# Altium schematic sheet Sheet1.SchDoc
size A; SheetNumber: 1; SheetTotal: 1
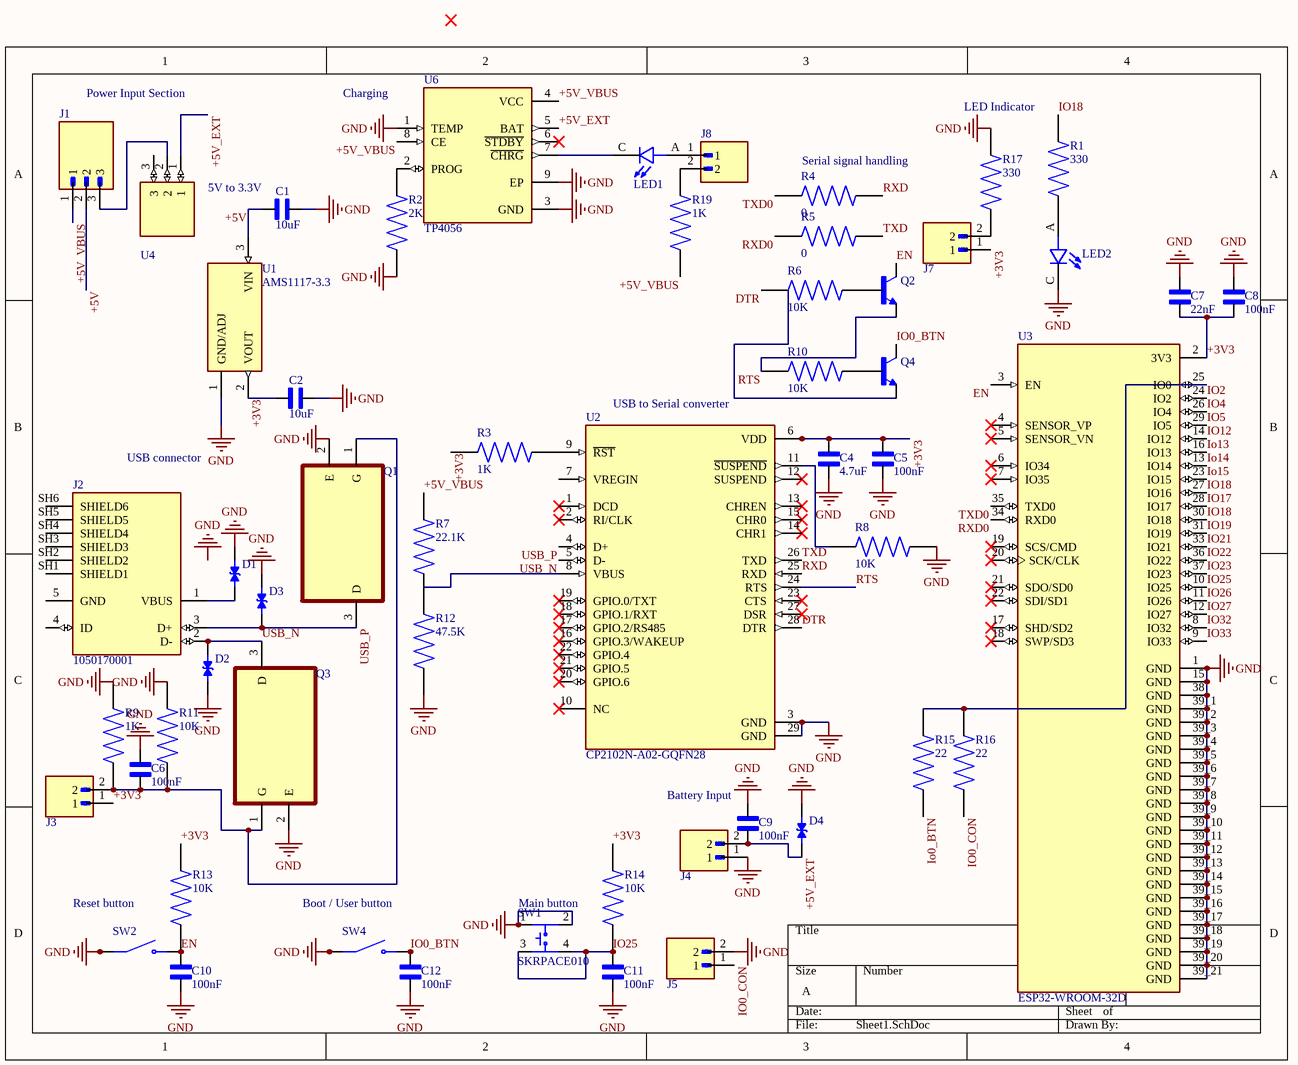
[diagram p0: Sheet1.SchDoc]

## Parts
C1  10uF  [CAPC1005X70N]
C2  10uF  [CAPC1005X70N]
C4  4.7uF  [CAPC1005X70N]
C5  100nF  [CAPC1005X70N]
C6  100nF  [CAPC1005X70N]
C7  22nF  [CAPC1005X70N]
C8  100nF  [CAPC1005X70N]
C9  100nF  [CAPC1005X70N]
C10  100nF  [CAPC1005X70N]
C11  100nF  [CAPC1005X70N]
C12  100nF  [CAPC1005X70N]
D1  LESD5D5.0CT1G  [TVS_LESD5D5.0CT1G]  (value not drawn)
D2  LESD5D5.0CT1G  [TVS_LESD5D5.0CT1G]  (value not drawn)
D3  LESD5D5.0CT1G  [TVS_LESD5D5.0CT1G]  (value not drawn)
D4  LESD5D5.0CT1G  [TVS_LESD5D5.0CT1G]  (value not drawn)
J1  M20-9990345  [HARWIN_M20-9990345]  (value not drawn)
J2  1050170001  [MOLEX_1050170001]
J3  M20-9990245  [HARWIN_M20-9990245]  (value not drawn)
J4  M20-9990245  [HARWIN_M20-9990245]  (value not drawn)
J5  M20-9990245  [HARWIN_M20-9990245]  (value not drawn)
J7  M20-9990245  [HARWIN_M20-9990245]  (value not drawn)
J8  M20-9990245  [HARWIN_M20-9990245]  (value not drawn)
LED1  SM0805UGC  [LEDC2012X135N]  (value not drawn)
LED2  SM0805UGC  [LEDC2012X135N]  (value not drawn)
Q1  2N7002T-7-F  [SOT50P160X90-3N]  (value not drawn)
Q2  SS8050-G  [TRANS_SS8050-G]  (value not drawn)
Q3  2N7002T-7-F  [SOT50P160X90-3N]  (value not drawn)
Q4  SS8050-G  [TRANS_SS8050-G]  (value not drawn)
R1  330  [RESC1005X40N]
R2  2K  [RESC1005X40N]
R3  1K  [RESC1005X40N]
R4  0  [RESC1005X40N]
R5  0  [RESC1005X40N]
R6  10K  [RESC1005X40N]
R7  22.1K  [RESC1005X40N]
R8  10K  [RESC1005X40N]
R9  1K  [RESC1005X40N]
R10  10K  [RESC1005X40N]
R11  10K  [RESC1005X40N]
R12  47.5K  [RESC1005X40N]
R13  10K  [RESC1005X40N]
R14  10K  [RESC1005X40N]
R15  22  [RESC1005X40N]
R16  22  [RESC1005X40N]
R17  330  [RESC1005X40N]
R19  1K  [RESC1005X40N]
SW1  SKRPACE010  [SW_SKRPACE010]
SW2  EVQ-P7A01P  [SW_EVQ-P7A01P]  (value not drawn)
SW4  EVQ-P7A01P  [SW_EVQ-P7A01P]  (value not drawn)
U1  AMS1117-3.3  [SOT229P700X180-4N]
U2  CP2102N-A02-GQFN28  [QFN50P500X500X80-29N]
U3  ESP32-WROOM-32D  [MODULE_ESP32-WROOM-32D]
U4  OS102011MA1QN1  [OS102011MA1QN1]  (value not drawn)
U6  TP4056  [SOP127P600X175-9N]

## Nets
GND: C1.1 C2.1 C4.1 C5.1 C6.2 C7.2 C8.2 C9.2 C10.1 C11.1 C12.1 D1.2 D2.1 D3.2 D4.2 J4.1 J5.2 LED2.C Q1.2(E) Q3.2(E) R2.1 R8.2 R9.2 R11.2 R12.1 R17.2 SW1.1 SW1.2 SW2.1_1 SW2.1_2 SW4.1_1 SW4.1_2 U1.1(GND/ADJ) U2.3(GND) U2.29(GND) U3.1(GND) U3.15(GND) U3.38(GND) U3.39_1(GND) U3.39_2(GND) U3.39_3(GND) U3.39_4(GND) U3.39_5(GND) U3.39_6(GND) U3.39_7(GND) U3.39_8(GND) U3.39_9(GND) U3.39_10(GND) U3.39_11(GND) U3.39_12(GND) U3.39_13(GND) U3.39_14(GND) U3.39_15(GND) U3.39_16(GND) U3.39_17(GND) U3.39_18(GND) U3.39_19(GND) U3.39_20(GND) U3.39_21(GND) U6.1(TEMP) U6.3(GND) U6.9(EP)
+3V3: C2.2 C4.2 C5.2 C7.1 C8.1 J3.1 J7.1 R3.2 R13.2 R14.2 U1.2(VOUT) U2.6(VDD) U2.7(VREGIN) U3.2(3V3)
+5V: C1.2 J1.2 U1.3(VIN)
+5V_EXT: C9.1 D4.1 J4.2 U4.1 U6.5(BAT)
+5V_VBUS: J1.1 R7.2 R19.1 U6.4(VCC) U6.8(CE)
DTR: R6.1 U2.28(DTR)
EN: C10.2 Q2.3(C) R13.1 SW2.2_1 SW2.2_2 U3.3(EN)
IO0_BTN: C12.2 Q4.3(C) R15.1 SW4.2_1 SW4.2_2
IO0_CON: J5.1 R16.1
IO2: U3.24(IO2)
IO4: U3.26(IO4)
IO5: U3.29(IO5)
IO12: U3.14(IO12)
Io13: U3.16(IO13)
Io14: U3.13(IO14)
Io15: U3.23(IO15)
IO17: U3.28(IO17)
IO18: R1.2 U3.27(IO16) U3.30(IO18)
IO19: U3.31(IO19)
IO21: U3.33(IO21)
IO22: U3.36(IO22)
IO23: U3.37(IO23)
IO25: C11.2 R14.1 SW1.3 SW1.4 U3.10(IO25)
IO26: U3.11(IO26)
IO27: U3.12(IO27)
IO32: U3.8(IO32)
IO33: U3.9(IO33)
RTS: Q2.2(E) R10.1 U2.24(RTS)
RXD: R4.2 U2.25(RXD)
RXD0: R5.1 U3.34(RXD0)
TXD: R5.2 U2.26(TXD)
TXD0: R4.1 U3.35(TXD0)
USB_N: D2.2 J2.2(D-) Q3.3(D) U2.5(D-)
USB_P: D3.1 J2.3(D+) Q1.3(D) U2.4(D+)
NetC6_1: C6.1 J3.2 Q1.1(G) Q3.1(G) R9.1 R11.1
NetD1_1: D1.1 J2.1(VBUS)
NetJ1_3: J1.3 U4.2
NetJ7_2: J7.2 R17.1
NetJ8_1: J8.1 LED1.A
NetJ8_2: J8.2 R19.2
NetLED1_C: LED1.C U6.7(~{CHRG})
NetLED2_A: LED2.A R1.1
NetQ2_1: Q2.1(B) R6.2
NetQ4_1: Q4.1(B) R10.2
NetR2_2: R2.2 U6.2(PROG)
NetR3_1: R3.1 U2.9(~{RST})
NetR8_1: R8.1 U2.11(~{SUSPEND})
NetR12_2: R12.2 U2.8(VBUS)
NetR15_2: R15.2 R16.2 U3.25(IO0)

Not connected (* = marked no-connect by the designer): J2 4(ID) 5(GND) SH1(SHIELD1) SH2(SHIELD2) SH3(SHIELD3) SH4(SHIELD4) SH5(SHIELD5) SH6(SHIELD6); Q4 2(E); R7 1; U2 1(DCD)* 2(RI/CLK)* 10(NC)* 12(SUSPEND)* 13(CHREN)* 14(CHR1)* 15(CHR0)* 16(GPIO.3/WAKEUP)* 17(GPIO.2/RS485)* 18(GPIO.1/RXT)* 19(GPIO.0/TXT)* 20(GPIO.6)* 21(GPIO.5)* 22(GPIO.4)* 23(CTS)* 27(DSR)*; U3 4(SENSOR_VP)* 5(SENSOR_VN)* 6(IO34)* 7(IO35)* 17(SHD/SD2)* 18(SWP/SD3)* 19(SCS/CMD)* 20(SCK/CLK)* 21(SDO/SD0)* 22(SDI/SD1)*; U4 3; U6 6(~{STDBY})*

## Notes on the sheet
- Power Input Section
- (near U6) Charging
- LED Indicator
- (near C1) 5V to 3.3V
- (near R4) Serial signal handling
- (near U2) USB to Serial converter
- (near J2) USB connector
- (near C9) Battery Input
- Reset button
- Boot / User button
- (near SW1) Main button
- Labels drawn without touching a wire or pin: GND

## Library data of the parts
C1 C2 C4 C6-C12 = CL05A475KP5NRNC: 4.7 ÂµF Â±10% 10V Ceramic Capacitor X5R 0402 (1005 Metric); MF: Samsung Electro-Mechanics; SnapEDA_Link: https://www.snapeda.com/parts/CL05A475KP5NRNC/Samsung/view-part/?ref=snap; Package: SMD-2-2 Samsung; Value: *; MP: CL05A475KP5NRNC; Check_prices: https://www.snapeda.com/parts/CL05A475KP5NRNC/Samsung/view-part/?ref=eda
C5 = CL05B104KO5NNNC: 0.1 ÂµF Â±10% 16V Ceramic Capacitor X7R 0402 (1005 Metric); MF: Samsung; SnapEDA_Link: https://www.snapeda.com/parts/CL05B104KO5NNNC/Samsung/view-part/?ref=snap; Package: SMD-2-2 Samsung; Value: *; MP: CL05B104KO5NNNC; Check_prices: https://www.snapeda.com/parts/CL05B104KO5NNNC/Samsung/view-part/?ref=eda
D1-D4 = LESD5D5.0CT1G: Transient Voltage Suppressors for ESD Protection; MF: Leshan Radio Co.; Check_prices: https://www.snapeda.com/parts/LESD5D5.0CT1G/Leshan+Radio+Co./view-part/?ref=eda; Value: *; Availability: Not in stock; Package: None; SnapEDA_Link: https://www.snapeda.com/parts/LESD5D5.0CT1G/Leshan+Radio+Co./view-part/?ref=snap; MP: LESD5D5.0CT1G; Price: None
J1 = M20-9990345: 2.54mm (0.1) Pitch SIL Vertical Throughboard Pin Header, 6.1mm mating pin height, gold (hi-temp mould), 3 contacts; MF: Harwin; SnapEDA_Link: https://www.snapeda.com/parts/M20-9990345/Harwin+Inc./view-part/?ref=snap; Package: None; Value: *; MP: M20-9990345; Check_prices: https://www.snapeda.com/parts/M20-9990345/Harwin+Inc./view-part/?ref=eda
J2 = 1050170001: USB - micro B USB 2.0 Receptacle Connector 5 Position Surface Mount, Right Angle; Through Hole; MF: Molex; SnapEDA_Link: https://www.snapeda.com/parts/1050170001/Molex/view-part/?ref=snap; Package: None; Value: *; MP: 1050170001; Check_prices: https://www.snapeda.com/parts/1050170001/Molex/view-part/?ref=eda
J3-J5 J7 J8 = M20-9990245: MF: Harwin; Package: None; Price: None; Value: *; MP: M20-9990245; Availability: Unavailable
LED1 LED2 = SM0805UGC: Green 565nm LED Indication - Discrete 2V 0805 _2012 Metric_; MF: Bivar Inc.; Package: 0805 Bivar; Value: *; Availability: Unavailable; MP: SM0805UGC; SnapEDA_Link: https://www.snapeda.com/parts/SM0805UGC/Bivar%20Inc./view-part/841191/?ref=snap; Price: None
Q1 Q3 = 2N7002T-7-F: MOSFET N-Channel 60V 0.115A SOT523 | Diodes Inc 2N7002T-7-F; MF: Diodes Inc.; SnapEDA_Link: https://www.snapeda.com/parts/2N7002T-7-F/Diodes+Inc./view-part/?ref=snap; Package: SOT-523 Diodes Inc.; Value: *; MP: 2N7002T-7-F; Check_prices: https://www.snapeda.com/parts/2N7002T-7-F/Diodes+Inc./view-part/?ref=eda
Q2 Q4 = SS8050-G: Bipolar (BJT) Transistor NPN 25 V 1.5 A 100MHz 300 mW Surface Mount SOT-23-3; MP: SS8050G; MF: Comchip; Digi-Key_Part_Number: 641-1790-2-ND; Check_prices: https://www.snapeda.com/parts/SS8050G/Comchip/view-part/?ref=eda; Package: None; SnapEDA_Link: https://www.snapeda.com/parts/SS8050G/Comchip/view-part/?ref=snap; Value: *
R1 R17 = 0402WGF3300TCE: 330 Ohm 1/16W Thick Film Resistor 0402 Chip - Surface Mount; MF: Uni-Royal; SnapEDA_Link: https://www.snapeda.com/parts/0402WGF3300TCE/Uni-Royal/view-part/?ref=snap; Package: 0402-2 ROYAL; Value: *; MP: 0402WGF3300TCE; Check_prices: https://www.snapeda.com/parts/0402WGF3300TCE/Uni-Royal/view-part/?ref=eda
R2 R3 R9 R19 = 0402WGF2001TCE: 2K Ohm 1/16W Thick Film Resistor 0402 Chip - Surface Mount; MF: Uni-Royal; SnapEDA_Link: https://www.snapeda.com/parts/0402WGF2001TCE/Uni-Royal/view-part/?ref=snap; Package: 0402-2 ROYAL; Value: *; MP: 0402WGF2001TCE; Check_prices: https://www.snapeda.com/parts/0402WGF2001TCE/Uni-Royal/view-part/?ref=eda
R4 R5 = 0402WGF0000TCE: 0 Ohm 1/16W Thick Film Resistor 0402 Chip - Surface Mount; MF: Uni-Royal; SnapEDA_Link: https://www.snapeda.com/parts/0402WGF0000TCE/Uni-Royal/view-part/?ref=snap; Package: None; Value: *; MP: 0402WGF0000TCE; Check_prices: https://www.snapeda.com/parts/0402WGF0000TCE/Uni-Royal/view-part/?ref=eda
R6-R8 R10-R16 = 0402WGF1001TCE: 1K Ohm 1/16W Thick Film Resistor 0402 Chip - Surface Mount; MF: Uni-Royal; SnapEDA_Link: https://www.snapeda.com/parts/0402WGF1001TCE/Uni-Royal/view-part/?ref=snap; Package: 0402-2 ROYAL; Value: *; MP: 0402WGF1001TCE; Check_prices: https://www.snapeda.com/parts/0402WGF1001TCE/Uni-Royal/view-part/?ref=eda
SW1 = SKRPACE010: Switch Tactile N.O. SPST Button J-Bend 0.05A 16VDC 2.55N SMD Automotive T/R; MF: ALPS; SnapEDA_Link: https://www.snapeda.com/parts/SKRPACE010/ALPS/view-part/376136/?ref=snap; Package: None; Price: None; MP: SKRPACE010; Availability: Good; Value: *; Check_prices: https://www.snapeda.com/parts/SKRPACE010/ALPS/view-part/376136/?ref=eda
SW2 SW4 = EVQ-P7A01P: Switch;Tactile;3.5x2.9mm;Right Angle;Light Touch Switch | Panasonic Electronic Components EVQ-P7A01P; SnapEDA_Link: https://www.snapeda.com/parts/EVQ-P7A01P/Panasonic+Electronic+Components/view-part/?ref=snap; Package: None; Value: *; MF: Panasonic Electronic Components; MP: EVQ-P7A01P; Check_prices: https://www.snapeda.com/parts/EVQ-P7A01P/Panasonic+Electronic+Components/view-part/?ref=eda
U1 = AMS1117-3.3: Sot223/Pkg 1-Amp 3.3-Volt Low Drop Out Voltage Regulatator; MF: Advanced Monolithic Systems; SnapEDA_Link: https://www.snapeda.com/parts/AMS1117-3.3/Advanced+Monolithic+Systems/view-part/?ref=snap; Package: SOT-223 Seeed Technology; Value: *; MP: AMS1117-3.3; Check_prices: https://www.snapeda.com/parts/AMS1117-3.3/Advanced+Monolithic+Systems/view-part/?ref=eda
U2 = CP2102N-A02-GQFN28: USB Bridge, USB to UART USB 2.0 UART Interface 28-QFN (5x5); MF: Silicon Labs; Value: *; Price: None; Package: WFQFN-28 Silicon Labs; Check_prices: https://www.snapeda.com/parts/CP2102N-A02-GQFN28/Silicon+Labs/view-part/?ref=eda; Availability: In Stock; SnapEDA_Link: https://www.snapeda.com/parts/CP2102N-A02-GQFN28/Silicon+Labs/view-part/?ref=snap; Purchase-URL: https://pricing.snapeda.com/search/part/CP2102N-A02-GQFN28/?ref=eda; MP: CP2102N-A02-GQFN28
U3 = ESP32-WROOM-32D: Bluetooth, WiFi 802.11b/g/n, Bluetooth v4.2 +EDR, Class 1, 2 and 3 Transceiver Module 2.4GHz ~ 2.5GHz Integrated; MF: Espressif Systems; SnapEDA_Link: https://www.snapeda.com/parts/ESP32-WROOM-32D/Espressif+Systems/view-part/?ref=snap; Package: Non Standard Espressif Systems; Value: *; MP: ESP32-WROOM-32D; Check_prices: https://www.snapeda.com/parts/ESP32-WROOM-32D/Espressif+Systems/view-part/?ref=eda
U4 = OS102011MA1QN1: Switch,Slide,Mini,SPDT,ON-ON,Non-Shorting(BBM),100mA,12VDC,ThruHole R/A,PC Pin | C&K OS102011MA1QN1; SnapEDA_Link: https://www.snapeda.com/parts/OS102011MA1QN1/C%2526K/view-part/?ref=snap; Package: None; Value: *; MF: C&K; MP: OS102011MA1QN1; Check_prices: https://www.snapeda.com/parts/OS102011MA1QN1/C%2526K/view-part/?ref=eda
U6 = TP4056: Complete single cell Li-Ion battery with a constant current / constant voltage linear charger; MF: NanJing Top Power ASIC Corp.; Check_prices: https://www.snapeda.com/parts/TP4056/NanJing+Top+Power+ASIC+Corp./view-part/?ref=eda; SnapEDA_Link: https://www.snapeda.com/parts/TP4056/NanJing+Top+Power+ASIC+Corp./view-part/?ref=snap; Price: None; Availability: Not in stock; Package: Package; MP: TP4056; Value: *